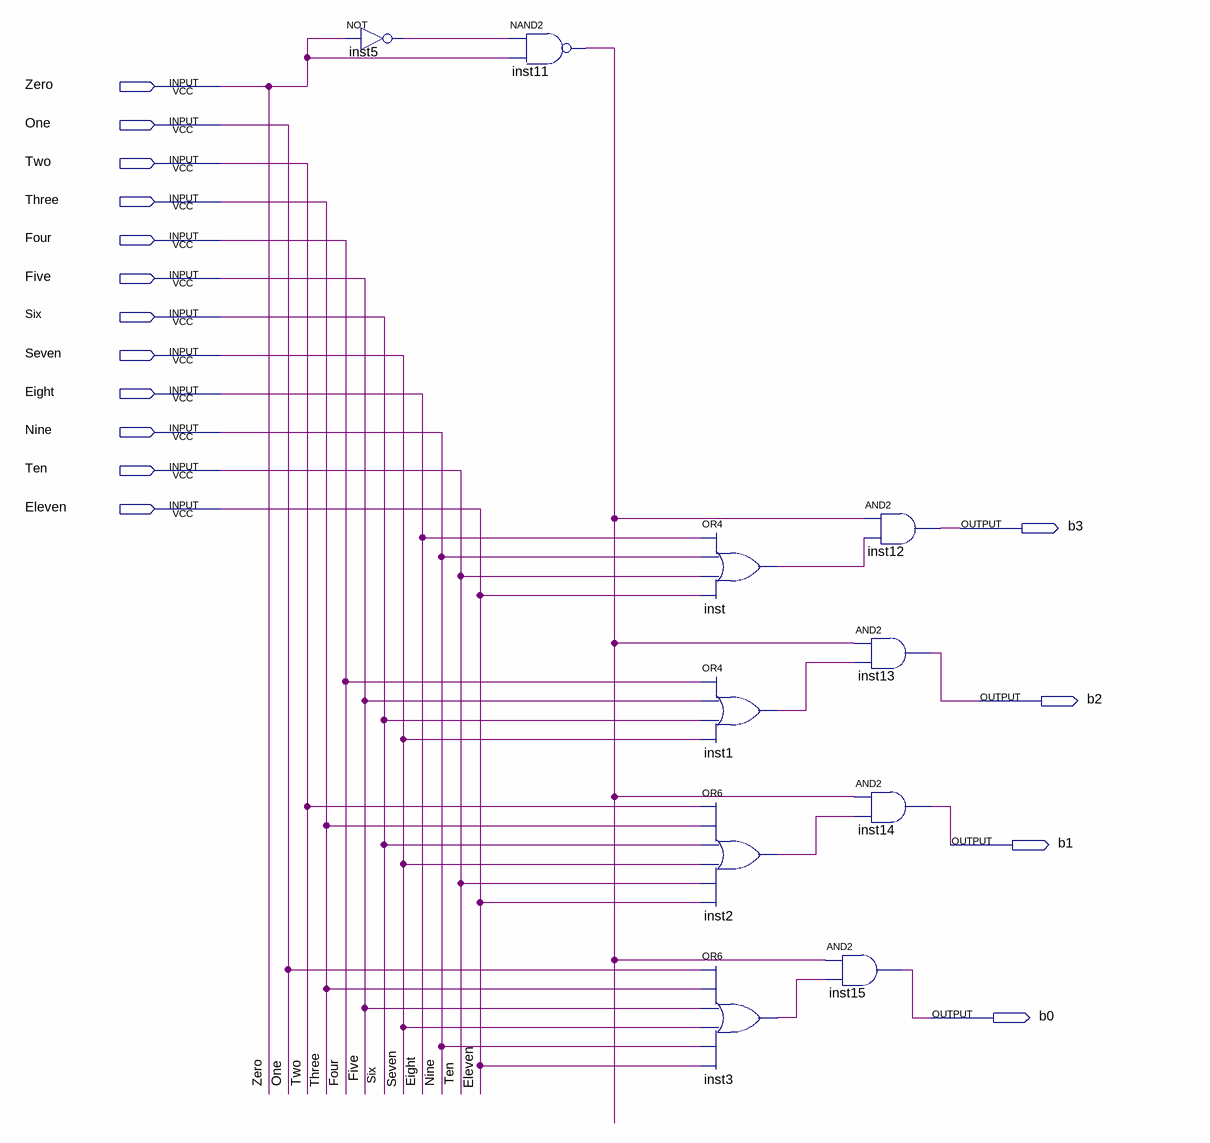
[diagram p0: schematic sheet]
// Quartus schematic deToBin.bdf as structural Verilog: 10 symbols, 16 pins
module deToBin (
  input  Zero,
  input  One,
  input  Two,
  input  Three,
  input  Four,
  input  Five,
  input  Six,
  input  Seven,
  input  Eight,
  input  Nine,
  input  Ten,
  input  Eleven,
  output b3,
  output b2,
  output b1,
  output b0
);

  wire inst1_out, inst2_out, inst3_out, inst5_out, inst11_out, inst_out;

  not inst5 (inst5_out, Zero);
  nand inst11 (inst11_out, inst5_out, Zero);
  or inst (inst_out, Eight, Nine, Ten, Eleven);
  or inst1 (inst1_out, Four, Five, Six, Seven);
  or inst2 (inst2_out, Two, Three, Six, Seven, Ten, Eleven);
  or inst3 (inst3_out, One, Three, Five, Seven, Nine, Eleven);
  and inst15 (b0, inst11_out, inst3_out);
  and inst12 (b3, inst11_out, inst_out);
  and inst13 (b2, inst11_out, inst1_out);
  and inst14 (b1, inst11_out, inst2_out);
endmodule
